# Altium schematic sheet CM Voltage Generator.SchDoc
size 406 x 203 mm
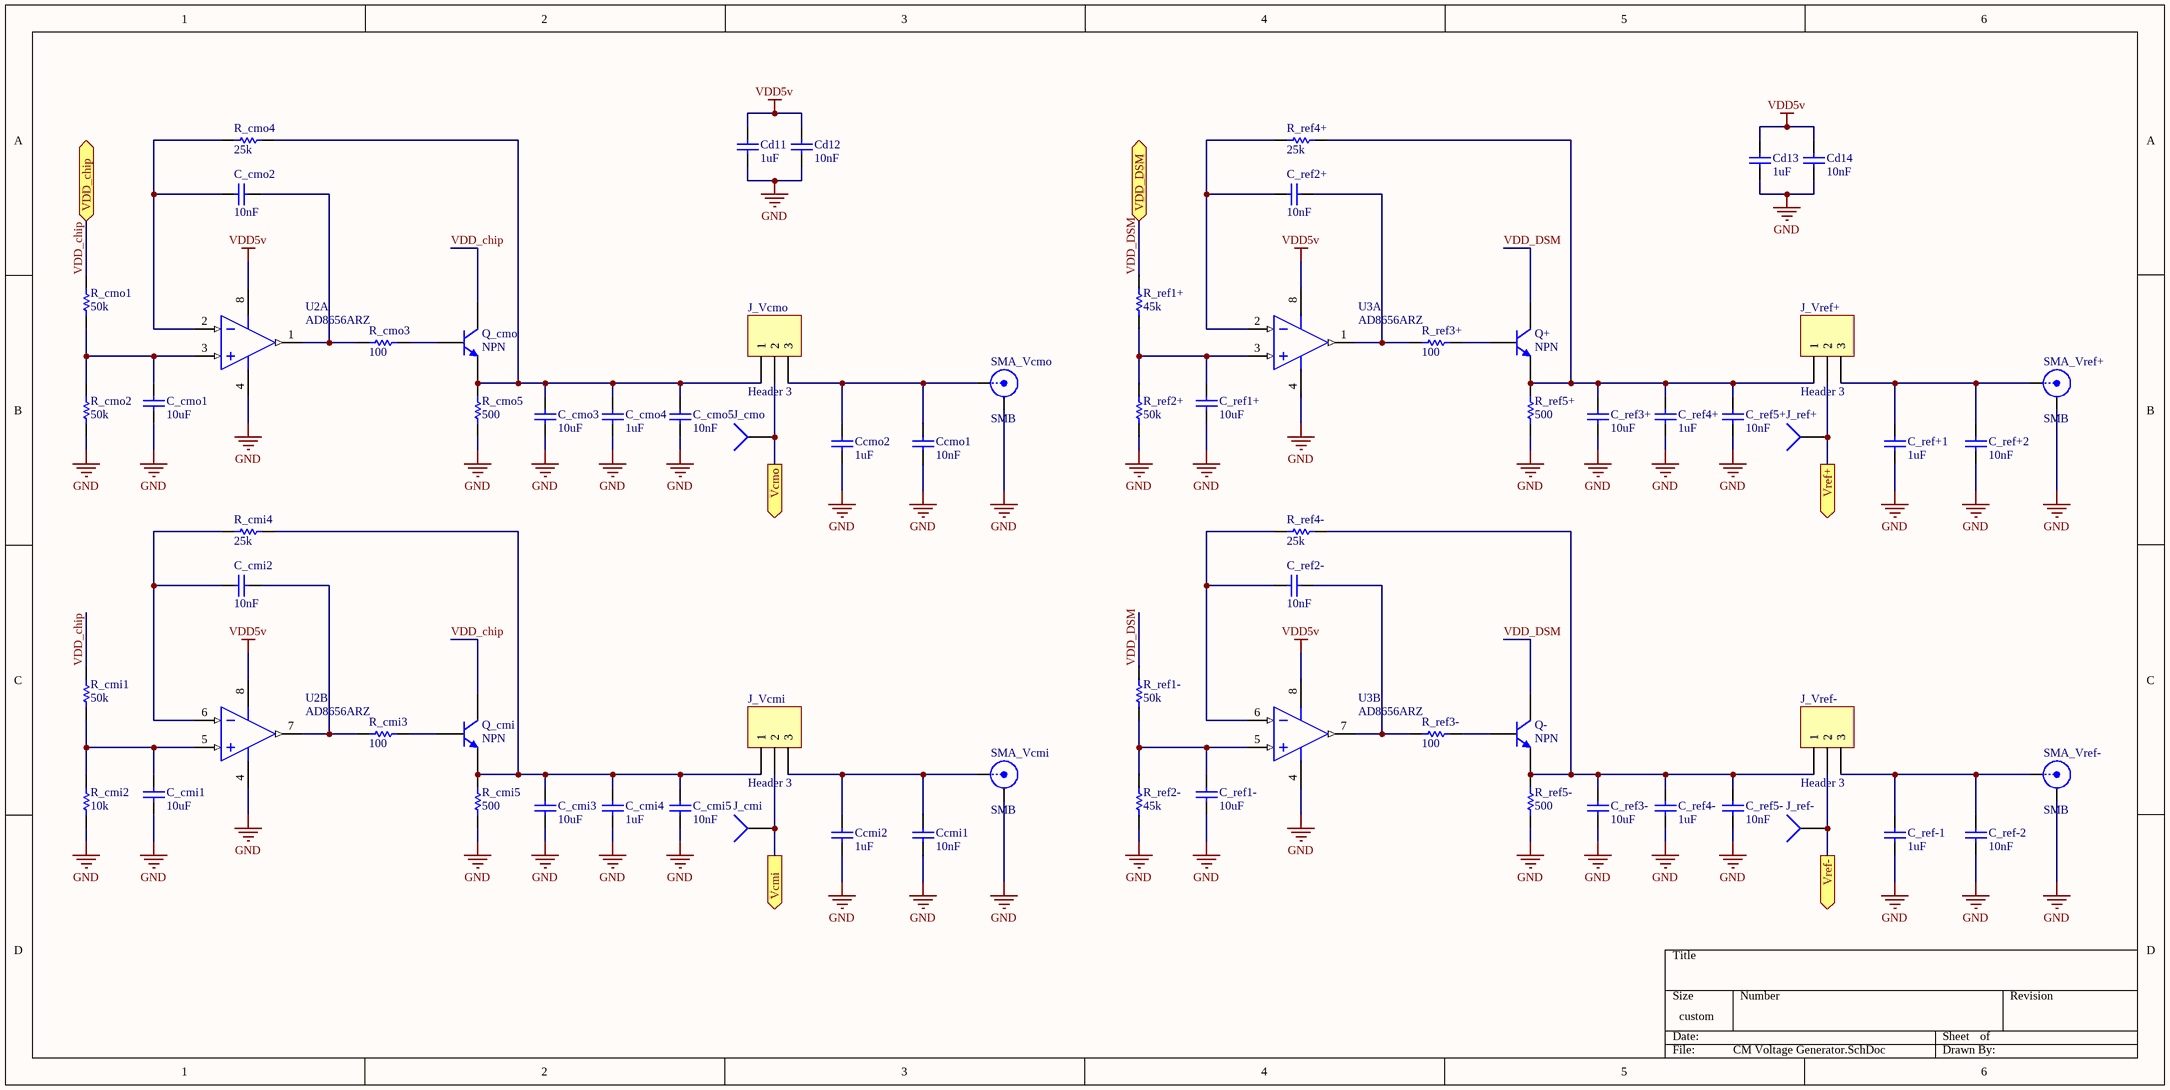
[diagram p0: CM Voltage Generator.SchDoc]

## Parts
C_cmi1  value 10uF  [1608[0603]]  (hidden comment: Cap)
C_cmi2  value 10nF  [1608[0603]]  (hidden comment: Cap)
C_cmi3  value 10uF  [1608[0603]]  (hidden comment: Cap)
C_cmi4  value 1uF  [1608[0603]]  (hidden comment: Cap)
C_cmi5  value 10nF  [1608[0603]]  (hidden comment: Cap)
C_cmo1  value 10uF  [1608[0603]]  (hidden comment: Cap)
C_cmo2  value 10nF  [1608[0603]]  (hidden comment: Cap)
C_cmo3  value 10uF  [1608[0603]]  (hidden comment: Cap)
C_cmo4  value 1uF  [1608[0603]]  (hidden comment: Cap)
C_cmo5  value 10nF  [1608[0603]]  (hidden comment: Cap)
C_ref1+  value 10uF  [1608[0603]]  (hidden comment: Cap)
C_ref1-  value 10uF  [1608[0603]]  (hidden comment: Cap)
C_ref2+  value 10nF  [1608[0603]]  (hidden comment: Cap)
C_ref2-  value 10nF  [1608[0603]]  (hidden comment: Cap)
C_ref3+  value 10uF  [1608[0603]]  (hidden comment: Cap)
C_ref3-  value 10uF  [1608[0603]]  (hidden comment: Cap)
C_ref4+  value 1uF  [1608[0603]]  (hidden comment: Cap)
C_ref4-  value 1uF  [1608[0603]]  (hidden comment: Cap)
C_ref5+  value 10nF  [1608[0603]]  (hidden comment: Cap)
C_ref5-  value 10nF  [1608[0603]]  (hidden comment: Cap)
C_ref+1  value 1uF  [1608[0603]]  (hidden comment: Cap)
C_ref+2  value 10nF  [1608[0603]]  (hidden comment: Cap)
C_ref-1  value 1uF  [1608[0603]]  (hidden comment: Cap)
C_ref-2  value 10nF  [1608[0603]]  (hidden comment: Cap)
Ccmi1  value 10nF  [1608[0603]]  (hidden comment: Cap)
Ccmi2  value 1uF  [1608[0603]]  (hidden comment: Cap)
Ccmo1  value 10nF  [1608[0603]]  (hidden comment: Cap)
Ccmo2  value 1uF  [1608[0603]]  (hidden comment: Cap)
Cd11  value 1uF  [1608[0603]]  (hidden comment: Cap)
Cd12  value 10nF  [1608[0603]]  (hidden comment: Cap)
Cd13  value 1uF  [1608[0603]]  (hidden comment: Cap)
Cd14  value 10nF  [1608[0603]]  (hidden comment: Cap)
J_cmi  Socket  [PIN1]  (value not drawn)
J_cmo  Socket  [PIN1]  (value not drawn)
J_ref+  Socket  [PIN1]  (value not drawn)
J_ref-  Socket  [PIN1]  (value not drawn)
J_Vcmi  Header 3  [HDR1X3]
J_Vcmo  Header 3  [HDR1X3]
J_Vref+  Header 3  [HDR1X3]
J_Vref-  Header 3  [HDR1X3]
Q+  NPN  [SOT-23_M]
Q-  NPN  [SOT-23_M]
Q_cmi  NPN  [SOT-23_M]
Q_cmo  NPN  [SOT-23_M]
R_cmi1  value 50k  [1608[0603]]  (hidden comment: Res1)
R_cmi2  value 10k  [1608[0603]]  (hidden comment: Res1)
R_cmi3  value 100  [1608[0603]]  (hidden comment: Res1)
R_cmi4  value 25k  [1608[0603]]  (hidden comment: Res1)
R_cmi5  value 500  [1608[0603]]  (hidden comment: Res1)
R_cmo1  value 50k  [1608[0603]]  (hidden comment: Res1)
R_cmo2  value 50k  [1608[0603]]  (hidden comment: Res1)
R_cmo3  value 100  [1608[0603]]  (hidden comment: Res1)
R_cmo4  value 25k  [1608[0603]]  (hidden comment: Res1)
R_cmo5  value 500  [1608[0603]]  (hidden comment: Res1)
R_ref1+  value 45k  [1608[0603]]  (hidden comment: Res1)
R_ref1-  value 50k  [1608[0603]]  (hidden comment: Res1)
R_ref2+  value 50k  [1608[0603]]  (hidden comment: Res1)
R_ref2-  value 45k  [1608[0603]]  (hidden comment: Res1)
R_ref3+  value 100  [1608[0603]]  (hidden comment: Res1)
R_ref3-  value 100  [1608[0603]]  (hidden comment: Res1)
R_ref4+  value 25k  [1608[0603]]  (hidden comment: Res1)
R_ref4-  value 25k  [1608[0603]]  (hidden comment: Res1)
R_ref5+  value 500  [1608[0603]]  (hidden comment: Res1)
R_ref5-  value 500  [1608[0603]]  (hidden comment: Res1)
SMA_Vcmi  SMB  [SMB_V-RJ45]
SMA_Vcmo  SMB  [SMB_V-RJ45]
SMA_Vref+  SMB  [SMB_V-RJ45]
SMA_Vref-  SMB  [SMB_V-RJ45]
U2  AD8656ARZ  [ADI-R-8_N]  (parts A,B of 2)
U3  AD8656ARZ  [ADI-R-8_N]  (parts A,B of 2)

## Ports
Vcmi (out), Vcmo (out), VDD_chip (bidir), VDD_DSM (bidir), Vref+ (out), Vref- (out)

## Nets
GND: C_cmi1.2 C_cmi3.2 C_cmi4.2 C_cmi5.2 C_cmo1.2 C_cmo3.2 C_cmo4.2 C_cmo5.2 C_ref1+.2 C_ref1-.2 C_ref3+.2 C_ref3-.2 C_ref4+.2 C_ref4-.2 C_ref5+.2 C_ref5-.2 C_ref+1.2 C_ref+2.2 C_ref-1.2 C_ref-2.2 Ccmi1.2 Ccmi2.2 Ccmo1.2 Ccmo2.2 Cd11.2 Cd12.2 Cd13.2 Cd14.2 R_cmi2.1 R_cmi5.2 R_cmo2.1 R_cmo5.2 R_ref2+.1 R_ref2-.1 R_ref5+.2 R_ref5-.2 SMA_Vcmi.2(Y) SMA_Vcmo.2(Y) SMA_Vref+.2(Y) SMA_Vref-.2(Y) U2.4(-V) U3.4(-V)
VDD5v: Cd11.1 Cd12.1 Cd13.1 Cd14.1 U2.8(+V) U3.8(+V)
Vcmi: J_cmi.1 J_Vcmi.2 ; port Vcmi
Vcmo: J_cmo.1 J_Vcmo.2 ; port Vcmo
VDD_chip: Q_cmi.1(C) Q_cmo.1(C) R_cmi1.2 R_cmo1.2 ; port VDD_chip
VDD_DSM: Q+.1(C) Q-.1(C) R_ref1+.2 R_ref1-.2 ; port VDD_DSM
Vref+: J_ref+.1 J_Vref+.2 ; port Vref+
Vref-: J_ref-.1 J_Vref-.2 ; port Vref-
NetC_cmi1_1: C_cmi1.1 R_cmi1.1 R_cmi2.2 U2.5(+IN_B)
NetC_cmi2_1: C_cmi2.1 R_cmi4.2 U2.6(-IN_B)
NetC_cmi2_2: C_cmi2.2 R_cmi3.2 U2.7(OUT_B)
NetC_cmi3_1: C_cmi3.1 C_cmi4.1 C_cmi5.1 J_Vcmi.1 Q_cmi.3(E) R_cmi4.1 R_cmi5.1
NetC_cmo1_1: C_cmo1.1 R_cmo1.1 R_cmo2.2 U2.3(+IN_A)
NetC_cmo2_1: C_cmo2.1 R_cmo4.2 U2.2(-IN_A)
NetC_cmo2_2: C_cmo2.2 R_cmo3.2 U2.1(OUT_A)
NetC_cmo3_1: C_cmo3.1 C_cmo4.1 C_cmo5.1 J_Vcmo.1 Q_cmo.3(E) R_cmo4.1 R_cmo5.1
NetC_ref1+_1: C_ref1+.1 R_ref1+.1 R_ref2+.2 U3.3(+IN_A)
NetC_ref1-_1: C_ref1-.1 R_ref1-.1 R_ref2-.2 U3.5(+IN_B)
NetC_ref2+_1: C_ref2+.1 R_ref4+.2 U3.2(-IN_A)
NetC_ref2+_2: C_ref2+.2 R_ref3+.2 U3.1(OUT_A)
NetC_ref2-_1: C_ref2-.1 R_ref4-.2 U3.6(-IN_B)
NetC_ref2-_2: C_ref2-.2 R_ref3-.2 U3.7(OUT_B)
NetC_ref3+_1: C_ref3+.1 C_ref4+.1 C_ref5+.1 J_Vref+.1 Q+.3(E) R_ref4+.1 R_ref5+.1
NetC_ref3-_1: C_ref3-.1 C_ref4-.1 C_ref5-.1 J_Vref-.1 Q-.3(E) R_ref4-.1 R_ref5-.1
NetC_ref+1_1: C_ref+1.1 C_ref+2.1 J_Vref+.3 SMA_Vref+.1(X)
NetC_ref-1_1: C_ref-1.1 C_ref-2.1 J_Vref-.3 SMA_Vref-.1(X)
NetCcmi1_1: Ccmi1.1 Ccmi2.1 J_Vcmi.3 SMA_Vcmi.1(X)
NetCcmo1_1: Ccmo1.1 Ccmo2.1 J_Vcmo.3 SMA_Vcmo.1(X)
NetQ+_2: Q+.2(B) R_ref3+.1
NetQ-_2: Q-.2(B) R_ref3-.1
NetQ_cmi_2: Q_cmi.2(B) R_cmi3.1
NetQ_cmo_2: Q_cmo.2(B) R_cmo3.1

## Library data of the parts
C_cmi1-C_cmi5 C_cmo1-C_cmo5 C_ref1+ C_ref1- C_ref2+ C_ref2- C_ref3+ C_ref3- C_ref4+ C_ref4- C_ref5+ C_ref5- C_ref+1 C_ref+2 C_ref-1 C_ref-2 Ccmi1 Ccmi2 Ccmo1 Ccmo2 Cd11-Cd14 = Cap: Capacitor; Published: 8-Jun-2000; LatestRevisionDate: 17-Jul-2002; LatestRevisionNote: Re-released for DXP Platform.; PackageReference: RAD-0.3; Publisher: Altium Limited; PackageDescription: Radial Cap, Thru-Hole; 2 Leads; 0.3 in Pin Spacing; Digi-Key: 445-7534-1-ND
J_Vcmi J_Vcmo J_Vref+ J_Vref- = Header 3: Header, 3-Pin; LatestRevisionDate: 17-Jul-2002; LatestRevisionNote: Re-released for DXP Platform.; Publisher: Altium Limited
Q+ Q- Q_cmi Q_cmo = NPN: NPN Bipolar Transistor; pin to pad: 1>3 2>1 3>2; Published: 8-Jun-2000; LatestRevisionDate: 17-Jul-2002; LatestRevisionNote: Re-released for DXP Platform.; PackageReference: TO-226-AA; Publisher: Altium Limited; PackageDescription: TO, Flat Index; 3 In-Line, Axial Leads; Body Dia. 4.8mm; Leads 0.55 x 0.51 mm (max); Code_JEDEC: TO-226-AA
R_cmi1-R_cmi5 R_cmo1-R_cmo5 R_ref1+ R_ref1- R_ref2+ R_ref2- R_ref3+ R_ref3- R_ref4+ R_ref4- R_ref5+ R_ref5- = Res1: Resistor; Published: 8-Jun-2000; LatestRevisionDate: 17-Jul-2002; LatestRevisionNote: Re-released for DXP Platform.; PackageReference: AXIAL-0.3; Publisher: Altium Limited; PackageDescription: Axial Device, Thru-Hole; 2 Leads; 0.3 in Pin Spacing; Digikey PN: P1.00KCCT-ND
SMA_Vcmi SMA_Vcmo SMA_Vref+ SMA_Vref- = SMB: SMB Straight Connector; LatestRevisionDate: 17-Jul-2002; LatestRevisionNote: Re-released for DXP Platform.; Publisher: Altium Limited
U2 U3 = AD8656ARZ: Double Channel RRIO Operational Amplifier, 28 MHz BW, 11 V/us SR, Industrial, 8-pin SOIC (R-8), Tube; Generic Part Number: AD8656; Manufacturer: Analog Devices; Amplifiers Per Package: 2; Automotive Qualified: Yes; Input Bias Current: 1pA; Input Offset Voltage: 50uV; Iq/Amp: 4.5mA; Slew Rate: 11V/us; Small Signal Bandwidth: 28MHz; V Span Max: 5.5V; V Span Min: 2.7V; DatasheetVersion: Rev. B; PackageVersion: 060506-A; PackageReference: R-8; PackageDescription: 8-Pin Standard Small Outline Package, Body 3.9 x 4.9 mm, Pitch 1.27 mm; Supplier 1: Digi-Key; Supplier Part Number 1: AD8656ARZ-ND; Supplier 2: Farnell; Supplier Part Number 2: 1117887; Supplier 3: Newark; Supplier Part Number 3: 19M0993; Mounting Technology: Surface Mount; Code_JEDEC: MS-012-AA; PartNumber: AD8656ARZ; ComponentLink1Description: Manufacturer URL; ComponentLink1URL: http://www.analog.com/en/index.html; ComponentLink2Description: Datasheet; ComponentLink2URL: http://www.analog.com/static/imported-files/data_sheets/AD8655_8656.pdf; ComponentLink3Description: Package Specification; ComponentLink3URL: http://www.analog.com/static/imported-files/packages/PKG_PDF/SOIC_Narrow%20(R)/R_8.pdf
J_cmi J_cmo J_ref+ J_ref- = Socket: LatestRevisionDate: 17-Jul-2002; LatestRevisionNote: Re-released for DXP Platform.; Publisher: Altium Limited